# Altium project Wings_SMD_Breakout.PrjPcb
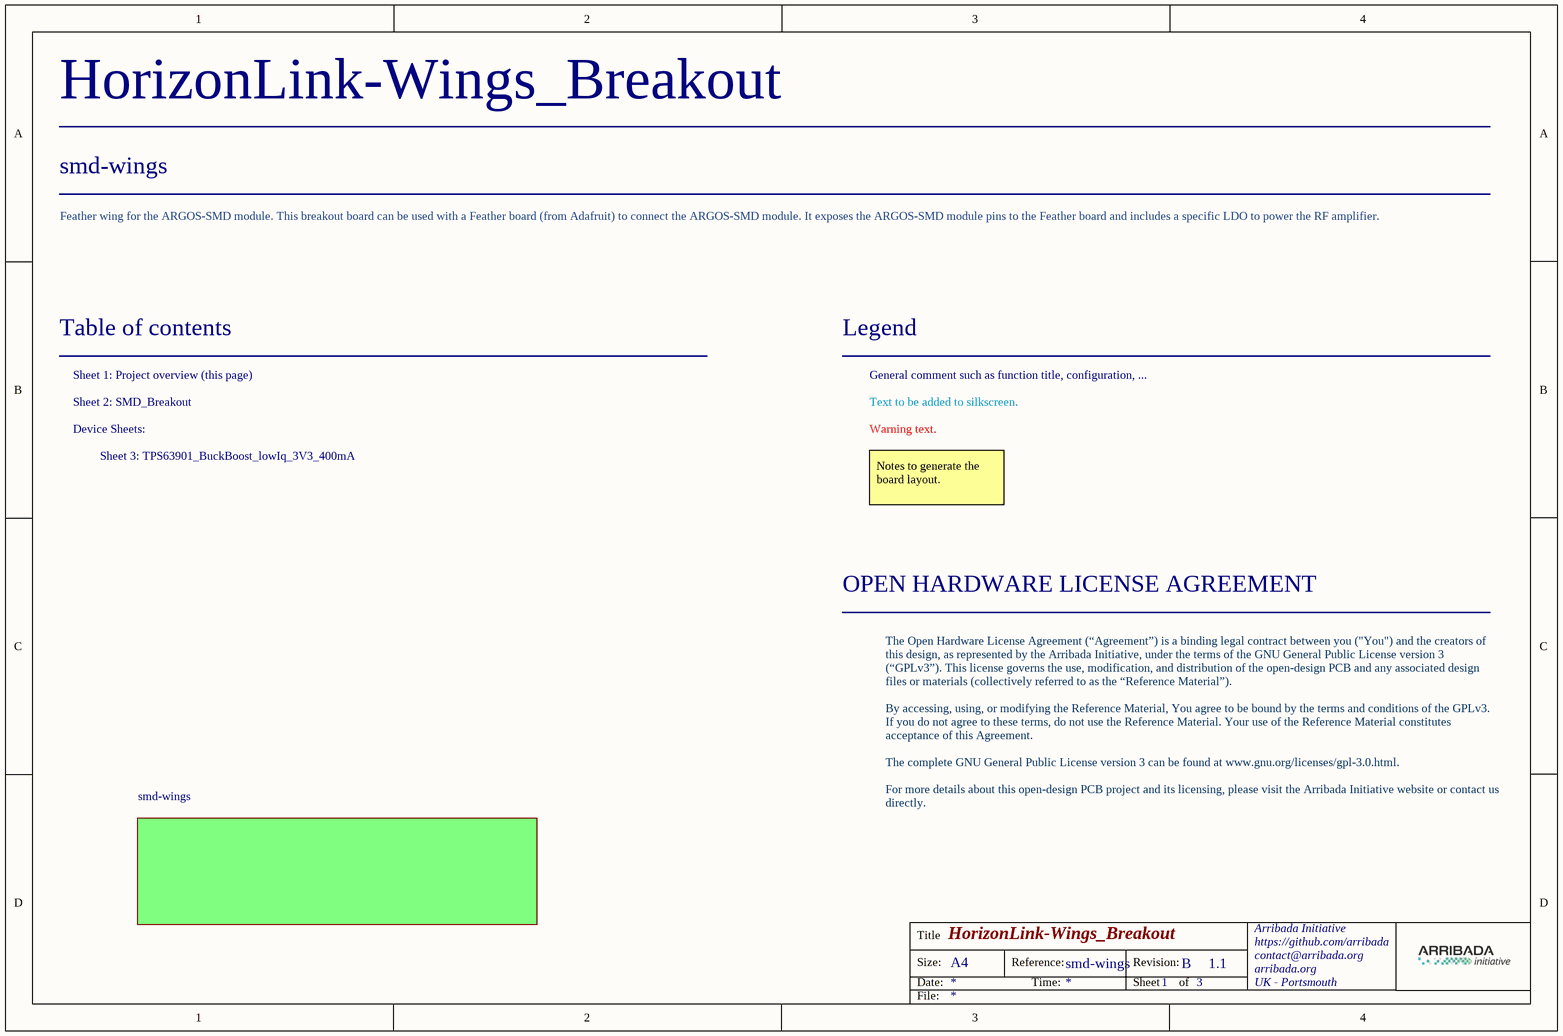
[diagram p0: Project_Overview.SchDoc]
Board_Reference: smd-wings; Board_PCB_Revision: B; Board_Name: HorizonLink-Wings_Breakout; Board_Document_Date: 09/2024; Board_Assembly_Revision: 1.1
2 sheets, 46 parts. Net scope: global (net labels, ports and power ports of the same name join across sheets).
Board file: Wings_SMD_Breakout_v1.1.PcbDoc
Sheets:
  Project_Overview.SchDoc
    smd-wings = SMD_Breakout.SchDoc

## Sheet Project_Overview.SchDoc
size A4; Organization: Arribada Initiative; Address1: https://github.com/arribada; Address2: contact@arribada.org; Address3: arribada.org; Address4: UK - Portsmouth; DocumentNumber: 1; SheetNumber: 1; SheetTotal: 3

### Sub-sheets
smd-wings = SMD_Breakout.SchDoc: no entries

### Notes on the sheet
- Feather wing for the ARGOS-SMD module. This breakout board can be used with a Feather board (from Adafruit) to connect the ARGOS-SMD module. It exposes the ARGOS-SMD module pins to the Feather board and includes a specific LDO to power the RF amplifier.
- Table of contents
- Sheet 1: Project overview (this page)
- Legend
- General comment such as function title, configuration, ...
- Sheet 2: SMD_Breakout
- Device Sheets:
- Text to be added to silkscreen.
- Warning text.
- Sheet 3: TPS63901_BuckBoost_lowIq_3V3_400mA
- Notes to generate the board layout.
- OPEN HARDWARE LICENSE AGREEMENT
- The Open Hardware License Agreement (“Agreement”) is a binding legal contract between you ("You") and the creators of this design, as represented by the Arribada Initiative, under the terms of the GNU General Public License version 3 (“GPLv3”). This license governs the use, modification, and distribution of the open-design PCB and any associated design files or materials (collectively referred to as the “Reference Material”).
  By accessing, using, or modifying the Reference Material, You agree to be bound by the terms and conditions of the GPLv3. If you do not agree to these terms, do not use the Reference Material. Your use of the Reference Material constitutes acceptance of this Agreement.
  The complete GNU General Public License version 3 can be found at www.gnu.org/licenses/gpl-3.0.html.
  For more details about this open-design PCB project and its licensing, please visit the Arribada Initiative website or contact us directly.
- Title
- Size:
- Date:
- A4
- Reference:
- Time:
- Revision:
- Sheet
- of
- File:

## Sheet SMD_Breakout.SchDoc
size A4; Organization: Arribada Initiative; Address1: https://github.com/arribada; Address2: contact@arribada.org; Address3: arribada.org; Address4: UK - Portsmouth; DocumentNumber: 2; SheetNumber: 2; SheetTotal: 3
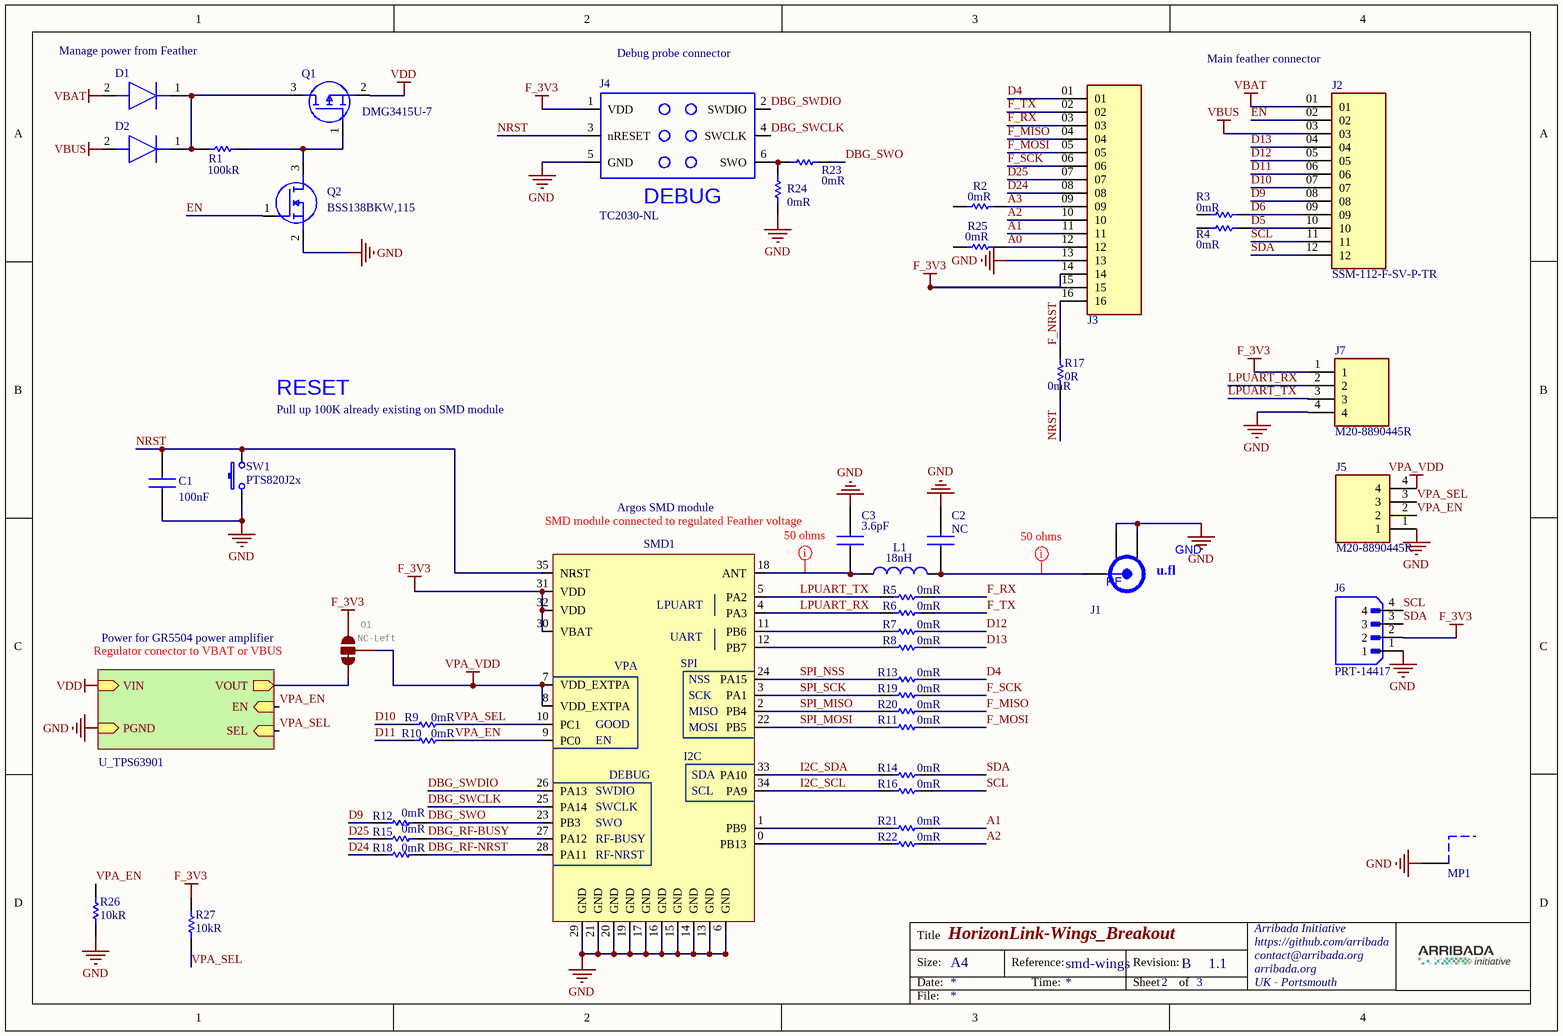
[diagram p1: SMD_Breakout.SchDoc]

### Parts
C1  value 100nF  [0402]  (hidden comment: GRM155R71C104KA88D)
C2  NC  [CAPC1005X55N]
C3  value 3.6pF  [CAPC1005X55N]  (hidden comment: CC0402BRNPO9BN3R6)
D1  MBR120LSFT3G  [SODFL3616X98N]  (value not drawn)
D2  MBR120LSFT3G  [SODFL3616X98N]  (value not drawn)
J1  20279-001E-01  [MHF SMT REC]  (value not drawn)
J2  SSM-112-F-SV-P-TR  [SAMTEC_SSM-112-F-SV-P-TR]
J3  SSM-116-F-SV-P-TR  [SAMTEC_SSM-116-F-SV-P-TR]  (value not drawn)
J4  TC2030-NL  [TC2030NL]
J5  M20-8890445R  [M208890445R]
J6  PRT-14417  [SPARKFUN_PRT-14417]
J7  M20-8890445R  [M208890445R]
L1  value 18nH  [LQW18AN10NG80D]  (hidden comment: LQW18AN18NG8ZD)
MP1  36103255S  [36103255S]  (value not drawn)
O1  NC-Left  [SMT-JUMPER_3_2-NCLEFT_TRACE_SILK]  (net tie, no BOM)
Q1  DMG3415U-7  [SOT96P240X120-3N]
Q2  BSS138BKW,115  [SOT65P210X110-3N]
R1  value 100kR  [RESC2012X60N]  (hidden comment: RC0805JR07100KL)
R2  value 0mR  [RESC1005X40N]  (hidden comment: 0R)
R3  value 0mR  [RESC1005X40N]  (hidden comment: 0R)
R4  value 0mR  [RESC1005X40N]  (hidden comment: 0R)
R5  value 0mR  [RESC1005X40N]  (hidden comment: 0R)
R6  value 0mR  [RESC1005X40N]  (hidden comment: 0R)
R7  value 0mR  [RESC1005X40N]  (hidden comment: 0R)
R8  value 0mR  [RESC1005X40N]  (hidden comment: 0R)
R9  value 0mR  [RESC1005X40N]  (hidden comment: 0R)
R10  value 0mR  [RESC1005X40N]  (hidden comment: 0R)
R11  value 0mR  [RESC1005X40N]  (hidden comment: 0R)
R12  value 0mR  [RESC1005X40N]  (hidden comment: 0R)
R13  value 0mR  [RESC1005X40N]  (hidden comment: 0R)
R14  value 0mR  [RESC1005X40N]  (hidden comment: 0R)
R15  value 0mR  [RESC1005X40N]  (hidden comment: 0R)
R16  value 0mR  [RESC1005X40N]  (hidden comment: 0R)
R17  0R  value 0mR  [RESC1005X40N]
R18  value 0mR  [RESC1005X40N]  (hidden comment: 0R)
R19  value 0mR  [RESC1005X40N]  (hidden comment: 0R)
R20  value 0mR  [RESC1005X40N]  (hidden comment: 0R)
R21  value 0mR  [RESC1005X40N]  (hidden comment: 0R)
R22  value 0mR  [RESC1005X40N]  (hidden comment: 0R)
R23  value 0mR  [RESC1005X40N]  (hidden comment: 0R)
R24  value 0mR  [RESC1005X40N]  (hidden comment: 0R)
R25  value 0mR  [RESC1005X40N]  (hidden comment: 0R)
R26  value 10kR  [RESC1005X40N]  (hidden comment: CRCW040210K0JNEDC)
R27  value 10kR  [RESC1005X40N]  (hidden comment: CRCW040210K0JNEDC)
SMD1  stm32wl-SMD  [stm32wl-SMD_noLegs]  (value not drawn)
SW1  PTS820J2x  [TL1015]

### Sub-sheets
U_TPS63901 = TPS63901_BuckBoost_lowIq_3V3_400mA (file not in this document): VIN (in), VOUT (out), EN (in), SEL (in), PGND (in)

### Nets
F_3V3: J3.14 J3.15 J4.1(VDD) J6.2 J7.1 O1.3 R27.1 SMD1.30(VBAT) SMD1.31(VDD) SMD1.32(VDD)
GND: C1.1 C2.1 C3.2 J1.2(GND) J1.3(GND) J3.13 J4.5(GND) J5.1 J6.1 J7.4 MP1.1 Q2.2(S) R24.1 R26.2 SMD1.6(GND) SMD1.13(GND) SMD1.14(GND) SMD1.15(GND) SMD1.16(GND) SMD1.17(GND) SMD1.19(GND) SMD1.20(GND) SMD1.21(GND) SMD1.29(GND) SW1.1 SW1.G1 SW1.G2 SW1.G3 SW1.G4 ; sheet U_TPS63901/PGND
VBAT: D1.2(A) J2.01
VBUS: D2.2(A) J2.03
VDD: Q1.2(S) ; sheet U_TPS63901/VIN
VPA_VDD: J5.4 O1.2 SMD1.7(VDD_EXTPA) SMD1.8(VDD_EXTPA)
A0: J3.12 R25.2
A1: J3.11 R21.1
A2: J3.10 R22.1
A3: J3.09 R2.2
D4: J3.01 R13.1
D5: J2.10 R4.2
D6: J2.09 R3.2
D9: J2.08 R12.1
D10: J2.07 R9.2
D11: J2.06 R10.2
D12: J2.05 R7.2
D13: J2.04 R8.2
D24: J3.08 R18.1
D25: J3.07 R15.1
DBG_RF-BUSY: R15.2 SMD1.27(PA12)
DBG_RF-NRST: R18.2 SMD1.28(PA11)
DBG_SWCLK: J4.4(SWCLK) SMD1.25(PA14)
DBG_SWDIO: J4.2(SWDIO) SMD1.26(PA13)
DBG_SWO: R12.2 R23.2 SMD1.23(PB3)
EN: J2.02 Q2.1(G)
F_MISO: J3.04 R20.1
F_MOSI: J3.05 R11.1
F_NRST: J3.16 R17.2
F_RX: J3.03 R5.1
F_SCK: J3.06 R19.1
F_TX: J3.02 R6.1
I2C_SCL: R16.2 SMD1.34(PA9)
I2C_SDA: R14.2 SMD1.33(PA10)
LPUART_RX: J7.2 R6.2 SMD1.4(PA3)
LPUART_TX: J7.3 R5.2 SMD1.5(PA2)
NRST: C1.2 J4.3(nRESET) R17.1 SMD1.35(NRST) SW1.2
SCL: J2.11 J6.4 R16.1
SDA: J2.12 J6.3 R14.1
SPI_MISO: R20.2 SMD1.2(PB4)
SPI_MOSI: R11.2 SMD1.22(PB5)
SPI_NSS: R13.2 SMD1.24(PA15)
SPI_SCK: R19.2 SMD1.3(PA1)
VPA_EN: J5.2 R10.1 R26.1 SMD1.9(PC0) ; sheet U_TPS63901/EN
VPA_SEL: J5.3 R9.1 R27.2 SMD1.10(PC1) ; sheet U_TPS63901/SEL
NetC2_2: C2.2 J1.1(RF) L1.2
NetC3_1: C3.1 L1.1 SMD1.18(ANT)
NetD1_1: D1.1(K) D2.1(K) Q1.3(D) R1.1
NetJ4_6: J4.6(SWO) R23.1 R24.2
NetO1_1: O1.1 ; sheet U_TPS63901/VOUT
NetQ1_1: Q1.1(G) Q2.3(D) R1.2
NetR7_1: R7.1 SMD1.11(PB6)
NetR8_1: R8.1 SMD1.12(PB7)
NetR21_2: R21.2 SMD1.1(PB9)
NetR22_2: R22.2 SMD1.0(PB13)

Not connected (* = marked no-connect by the designer): R2 1; R3 1; R4 1; R25 1

### Layout directives
net class 50Ohms: NetC2_2, NetC3_1

### Notes on the sheet
- (near D1) Manage power from Feather
- (near J4) Debug probe connector
- (near J2) Main feather connector
- RESET
- Pull up 100K already existing on SMD module
- Argos SMD module
- (near C3) SMD module connected to regulated Feather voltage
- (near J1) u.fl
- (near O1) Regulator conector to VBAT or VBUS
- (near O1) Power for GR5504 power amplifier
- Title
- Size:
- Date:
- A4
- Reference:
- Time:
- Revision:
- Sheet
- of
- File:
- (in symbol stm32wl-SMD) LPUART; UART; VPA; SPI; NSS; SCK; MISO; GOOD; MOSI; EN; I2C; DEBUG; SDA; SWDIO; SCL; SWCLK; SWO; RF-BUSY; RF-NRST
- (in symbol TC2030-NL) DEBUG

### Library data of the parts
C1 = GRM155R71C104KA88D: Multilayer Ceramic Capacitors MLCC - SMD/SMT 0.1 uF 16 VDC 10% 0402 X7R; Manufacturer_Part_Number: CC0402KRX7R7BB104; Manufacturer: YAGEO; Manufacturer 1: Murata; Description 1: 0402 0.1 uF 16V ±10 % Tolerance X7R SMT Multilayer Ceramic Capacitor; Voltage Rating: 16V; Package: C0402; Supplier 1: Mouser; Supplier Part Number 1: 81-GRM155R71C104KA88; Manufacturer Part Number 1: GRM155R71C104KA88D; RoHS 1: Yes; Category 1: Ceramic Capacitors; Stock 1: 7816691; Pricing 1: 1=0,1, 10=0,017, 50=0,017, 100=0,01, 1000=0,008, 10000=0,005 (USD); Mount: Surface Mount; Case/Package: 0402; Number of Pins: 2; Case Code (Metric): 1005; Case Code (Imperial): 0402; Material: Ceramic; Dielectric Material: Ceramic; Min Operating Temperature: -55°C; Max Operating Temperature: 125°C; Capacitance: 100nF; Tolerance: 10%; Packaging: Tape and Reel; Voltage Rating (DC): 16V; Package Quantity: 1; Dielectric: X7R; Termination: SMD/SMT; Voltage: 16V; Series: GRM; Length: 1mm; Width: 0.02inch; Height: 0.5mm; Thickness: 0.022inch; Depth: 0.5mm; Radiation Hardening: No; Lead Free: Lead Free; RoHS Compliant: Yes; Reach SVHC Compliant: Unknown; ComponentLink1URL: https://datasheet.ciiva.com/129/grm155r71c104ka88-01-129739.pdf?src-supplier=Digi-Key; ComponentLink1Description: https://datasheet.ciiva.com/129/grm155r71c104ka88-01-129739.pdf?src-supplier=Digi-Key; ComponentLink2URL: https://datasheet.ciiva.com/129/grm155r71c104ka88-01-129740.pdf?src-supplier=Digi-Key; ComponentLink2Description: https://datasheet.ciiva.com/129/grm155r71c104ka88-01-129740.pdf?src-supplier=Digi-Key; ComponentLink3URL: https://datasheet.ciiva.com/29199/454098-da-01-en-vs-kondensator-0402-29199799.pdf?src-supplier=Conrad; ComponentLink3Description: https://datasheet.ciiva.com/29199/454098-da-01-en-vs-kondensator-0402-29199799.pdf?src-supplier=Conrad; ComponentLink4URL: https://datasheet.ciiva.com/7937/4360-7937615.pdf?src-supplier=Element14; ComponentLink4Description: https://datasheet.ciiva.com/7937/4360-7937615.pdf?src-supplier=Element14; ComponentLink5URL: https://datasheet.ciiva.com/14116/grmseries-highdielectrictype-eng-14116878.pdf?src-supplier=Distrelec; ComponentLink5Description: https://datasheet.ciiva.com/14116/grmseries-highdielectrictype-eng-14116878.pdf?src-supplier=Distrelec; ComponentLink6URL: https://datasheet.ciiva.com/14103/grmseries-highdielectrictype-eng-14103750.pdf?src-supplier=Distrelec; ComponentLink6Description: https://datasheet.ciiva.com/14103/grmseries-highdielectrictype-eng-14103750.pdf?src-supplier=Distrelec; ComponentLink7URL: https://datasheet.ciiva.com/28534/4360-28534127.pdf?src-supplier=Element14; ComponentLink7Description: https://datasheet.ciiva.com/28534/4360-28534127.pdf?src-supplier=Element14; ComponentLink8URL: https://datasheet.ciiva.com/28534/4360-28534133.pdf?src-supplier=Element14; ComponentLink8Description: https://datasheet.ciiva.com/28534/4360-28534133.pdf?src-supplier=Element14
C2 = GEN_CAP_0402: Generic capacitor; ComponentLink1Description: Mouser; ComponentLink1URL: https://www.mouser.fr/ProductDetail/Murata-Electronics/GCM1555C1H4R7CA16D?qs=jDWTHf1mkXZYnVNtgyfFgw%3D%3D
C3 = CC0402BRNPO9BN3R6: Multilayer Ceramic Capacitors MLCC - SMD/SMT 50 V 3.6pF C0G 0402 Tol 0.1pF; Manufacturer_Name: KEMET; Datasheet Link: https://www.yageo.com/upload/media/product/productsearch/datasheet/mlcc/UPY-GP_NP0_16V-to-50V_18.pdf; Height: 0.55mm; Manufacturer_Part_Number: CC0402BRNPO9BN3R6; Mouser Part Number: 603-CC402BRNPO9BN3R6; Mouser Price/Stock: https://www.mouser.co.uk/ProductDetail/Yageo/CC0402BRNPO9BN3R6?qs=57cj7OiSijl%2FHGuB4N4%2Few%3D%3D; Arrow Part Number: CC0402BRNPO9BN3R6; Arrow Price/Stock: https://www.arrow.com/en/products/cc0402brnpo9bn3r6/yageo
D1 D2 = MBR120LSFT3G: Schottky Diodes & Rectifiers 1A 20V; Manufacturer_Name: onsemi; Datasheet Link: http://www.onsemi.com/pub/Collateral/MBR120LSFT1-D.PDF; Height: 0.98mm; Manufacturer_Part_Number: MBR120LSFT3G; Mouser Part Number: 863-MBR120LSFT3G; Mouser Price/Stock: https://www.mouser.co.uk/ProductDetail/onsemi/MBR120LSFT3G?qs=3JMERSakebrl0QzFyBgvHg%3D%3D; Arrow Part Number: MBR120LSFT3G; Arrow Price/Stock: https://www.arrow.com/en/products/mbr120lsft3g/on-semiconductor?region=nac
J1 = 20279-001E-01: CON IPEX MHF SMT RECEPTACLE RF DC - 6GHZ VSWR: 1.3 max. at 0.1-3GHz; VSWR: 1.5 max. at 3-6GHz; Manufacturer: Taoglas; Manufacturers Part Number: RECE-20279-001E-01; Size: MHF; Frequency Range: DC - 6GHz; Supplier 1: Digi-Key; Supplier 2: Mouser; Supplier Part Number 1: 931-1107-1-ND; Supplier Part Number 2: 960-RECE20279001E01; Distributor 1: EBV; Distributor 2: Future Electronics
J2 = SSM-112-F-SV-P-TR: Headers & Wire Housings Surface Mount, 12pos, PCB Socket Strips, .100" pitch
J3 = SSM-116-F-SV-P-TR: Headers & Wire Housings Surface Mount, 16pos,  PCB Socket Strips, .100" pitch; Supplier 1: Digi-Key; Supplier Part Number 1: SSM-116-F-SV-P-ND; Supplier 2: Digi-Key; Supplier Part Number 2: SSM-116-F-SV-ND
J4 = TC2030-NL: CON PLUG OF NAILS 6 PIN FOOTPRINT NO LEGS; Manufacturer: Tag-Connect; Manufacturers Part Number: NOT FITTED PART; Supplier Part Number 1: NOT FITTED PART; Supplier Part Number 2: NOT FITTED PART; Distributor 1: EBV; Distributor 2: Future Electronics
J5 J7 = M20-8890445R: Connector; Manufacturer_Name: Harwin; Datasheet Link: https://cdn.harwin.com/pdfs/M20-889.pdf; Height: 2.65mm; Manufacturer_Part_Number: M20-8890445R; Mouser Part Number: 855-M20-8890445R; Mouser Price/Stock: https://www.mouser.co.uk/ProductDetail/Harwin/M20-8890445R?qs=k41KVqW3ymoiw3ZBsQPrmw%3D%3D
J6 = PRT-14417: QWIIC JST CONNECTOR - SMD 4-PIN; MF: SparkFun Electronics; SnapEDA_Link: https://www.snapeda.com/parts/PRT-14417/SparkFun+Electronics/view-part/?ref=snap; Package: None; Value: *; MP: PRT-14417; Check_prices: https://www.snapeda.com/parts/PRT-14417/SparkFun+Electronics/view-part/?ref=eda
L1 = LQW18AN18NG8ZD: Inductor Wirewound , 18 nH, 75 Milliohm, ± 2%, 1.4 A, 0603 [1608 Metric]; Supplier 1: Mouser; Supplier Part Number 1: 81-LQW18AN18NG8ZD
MP1 = 36103255S: WE-SHC Shielding Cabinet, SMT Frame, Tin Plated, Tray, 25x25x3mm; Manufacturer: Wurth Elektronik; Base Material: Steel; ComponentLink1Description: Website Link; ComponentLink1URL: https://www.we-online.com/redexpert/article/36103255S?ad; ComponentLink2Description: Datasheet Link; ComponentLink2URL: https://www.we-online.com/redexpert/spec/36103255S?ad; Manufacturer Part Number: 36103255S; Category: EMC Shielding; Match Code: WE-SHC; Mount: Surface Mount; Operating Temperature Max: 125°C; Operating Temperature Min: -40°C; Packaging: Tray; Length: 25mm; Width: 25mm; Height: 3mm; Plating: Tin Plated; Type: SMT Frame
O1 = JUMPER-SMT_3_2-NCLEFT_TRACE_SILK: Normally opened lefttrace jumper (1 of 2 connections)    This jumper has a trace between left pad pads so they are normally closed (NC). Use a razor knife to open the connection(s). For best results follow the IPC guidelines for cutting traces: Cutout at least 0.063 mm (0.005 in).  Remove all loose material to clean up the cut area.  Seal the cut with an approved epoxy.       Reapply solder to reclose the connection(s).; GateName_1: G$1; SymbolName_1: SMT-JUMPER_3_2-NC_TRACE; DeviceName: _SILK; DeviceSetName: JUMPER-SMT_3_2-NC_TRACE; LibraryName: SparkFun-Jumpers
Q1 = DMG3415U-7: MOSFET (P-Channel) 16V Enh FET 8Vgss -12A 0.65W; Manufacturer_Name: Diodes Inc.; Datasheet Link: https://datasheet.datasheetarchive.com/originals/distributors/Datasheets-DGA23/1579852.pdf; Height: 1.2mm; Manufacturer_Part_Number: DMG3415U-7; Mouser Part Number: 621-DMG3415U-7; Mouser Price/Stock: https://www.mouser.co.uk/ProductDetail/Diodes-Incorporated/DMG3415U-7?qs=oUsD4qhOtFwqFLkI6WCRAA%3D%3D; Arrow Part Number: DMG3415U-7; Arrow Price/Stock: https://www.arrow.com/en/products/dmg3415u-7/diodes-incorporated?region=nac
Q2 = BSS138BKW,115: MOSFET (N-Channel); Manufacturer_Name: Nexperia; Datasheet Link: https://assets.nexperia.com/documents/data-sheet/BSS138BKW.pdf; Height: 1.1mm; Manufacturer_Part_Number: BSS138BKW,115; Mouser Part Number: 771-BSS138BKW115; Mouser Price/Stock: https://www.mouser.co.uk/ProductDetail/Nexperia/BSS138BKW115?qs=A1cBxND5mHJ1Grk7RQmcgg%3D%3D; Arrow Part Number: BSS138BKW,115; Arrow Price/Stock: https://www.arrow.com/en/products/bss138bkw115/nexperia?region=nac
R1 = RC0805JR07100KL: Thick Film Resistors - SMD 100 kOhms 125 mW 0805 5%; Manufacturer_Name: KEMET; Datasheet Link: https://www.yageo.com/upload/media/product/productsearch/datasheet/rchip/PYu-RC_Group_51_RoHS_L_11.pdf; Height: 0.6mm; Manufacturer_Part_Number: RC0805JR07100KL; Arrow Part Number: RC0805JR07100KL; Arrow Price/Stock: https://www.arrow.com/en/products/rc0805jr-07100kl/yageo?region=nac
R2-R25 = CRCW04020000Z0ED: Thick Film Resistors  - SMD 0402 0.063 W 0 Ohm Jumper; Manufacturer 1: Vishay; Description 1: CRCW Series 0402 0.063 W 0 Ohm Jumper Surface Mount Thick Film Chip Resistor; Category 1: Chip SMD Resistors; Power Rating: 63mW; Voltage Rating: 50V; Temperature Coefficient: 100ppm/°C; Tolerance: 5%; Supplier 1: Digi-Key; Supplier Part Number 1: 541-0.0JCT-ND; Manufacturer Part Number 1: CRCW04020000Z0ED; RoHS 1: Yes; Stock 1: 170588; Pricing 1: 1=0,1, 10=0,029, 25=0,0208, 50=0,016, 100=0,0118, 250=0,009, 500=0,0072, 1000=0,0053, 5000=0,0038 (USD); Case/Package: 0402; Case Code (Imperial): 0402; Case Code (Metric): 1005; Contact Plating: Tin; Size Code: 0402; Weight: 2.3E-05oz; Min Operating Temperature: -55°C; Max Operating Temperature: 155°C; Packaging: Tape and Reel; Resistance: 0mR; Series: CRCW; Number of Terminations: 2; Max Power Dissipation: 63mW; Termination: SMD/SMT; Package Quantity: 10000; Resistor Type: Thick Film; Voltage Rating (DC): 50V; Features: Automotive AEC-Q200; Construction: Rectangular; Length: 1mm; Width: 0.5mm; Height: 0.35mm; Depth: 0.5mm; Ratings: AEC-Q200; Radiation Hardening: No; RoHS Compliant: Yes; Lead Free: Lead Free; Reach SVHC Compliant: Unknown; Military Standard: Not; ComponentLink1URL: https://datasheet.ciiva.com/3255/dcrcwe3-3255944.pdf?src-supplier=Avnet; ComponentLink1Description: https://datasheet.ciiva.com/3255/dcrcwe3-3255944.pdf?src-supplier=Avnet; ComponentLink2URL: https://datasheet.ciiva.com/3255/dcrcwe3-3255945.pdf?src-supplier=Avnet; ComponentLink2Description: https://datasheet.ciiva.com/3255/dcrcwe3-3255945.pdf?src-supplier=Avnet; ComponentLink3URL: https://datasheet.ciiva.com/2461/dcrcwe3-2461962.pdf?src-supplier=Digi-Key; ComponentLink3Description: https://datasheet.ciiva.com/2461/dcrcwe3-2461962.pdf?src-supplier=Digi-Key; ComponentLink4URL: https://datasheet.ciiva.com/7841/1720486-7841802.pdf?src-supplier=Element14; ComponentLink4Description: https://datasheet.ciiva.com/7841/1720486-7841802.pdf?src-supplier=Element14; ComponentLink5URL: https://datasheet.ciiva.com/2461/dcrcwe3-2461964.pdf?src-supplier=Digi-Key; ComponentLink5Description: https://datasheet.ciiva.com/2461/dcrcwe3-2461964.pdf?src-supplier=Digi-Key; ComponentLink6URL: https://datasheet.ciiva.com/7841/1697337-7841468.pdf?src-supplier=Element14; ComponentLink6Description: https://datasheet.ciiva.com/7841/1697337-7841468.pdf?src-supplier=Element14; ComponentLink7URL: https://datasheet.ciiva.com/16761/70200976-16761309.pdf?src-supplier=Allied+Electronics; ComponentLink7Description: https://datasheet.ciiva.com/16761/70200976-16761309.pdf?src-supplier=Allied+Electronics; ComponentLink8URL: https://datasheet.ciiva.com/26311/fld-crcw-e3-data-en-26311550.pdf?src-supplier=Distrelec; ComponentLink8Description: https://datasheet.ciiva.com/26311/fld-crcw-e3-data-en-26311550.pdf?src-supplier=Distrelec
R26 R27 = CRCW040210K0JNEDC: Thick Film Resistors - SMD 1/16watt 10Kohms 5% Commercial Use; Manufacturer: Vishay Semiconductors; Power Rating: 63mW; Voltage Rating: 50V; Supplier 1: Mouser; Manufacturer Part Number: CRCW040210K0JNEDC; RoHS: Yes; Category: Chip SMD Resistors; Stock 1: 229087; Pricing 1: 1=0,1, 10=0,013, 50=0,013, 100=0,007, 1000=0,005, 10000=0,004 (USD); Case/Package: 343Case; Resistance: 10kR; Tolerance: 5%; Height: 350um; Lead Free: 5697LeadFree; ComponentLink1URL: http://www.vishay.com/docs/28773/crcwce3.pdf?src-supplier=Digikey; ComponentLink1Description: http://www.vishay.com/docs/28773/crcwce3.pdf?src-supplier=Digikey; ComponentLink2URL: https://datasheet.octopart.com/CRCW040210K0JNEDC-Vishay-datasheet-100063072.pdf?src-supplier=Future+Electronics; ComponentLink2Description: https://datasheet.octopart.com/CRCW040210K0JNEDC-Vishay-datasheet-100063072.pdf?src-supplier=Future+Electronics; Supplier Part Number 1: 71-CRCW040210K0JNEDC
SMD1 = stm32wl-SMD: Arribada SMD module Argos comunication with PA GR5504
SW1 = PTS820J2x: SW SPST PB 50MA 12V SMT CK variant; Manufacturer: C&K; Manufacturers Part Number: PTS820J2xM SMTR LFS; Supplier 1: Mouser; Supplier 2: Digi-Key; Supplier Part Number 1: 611-PTS820J25MSMTR; Supplier Part Number 2: CKN10505CT-ND; Distributor 1: EBV; Distributor 2: Future Electronics; Value: PTS820J2x

## Assembly variants
only_uart: not fitted C2 MP1 R2 R3 R4 R7 R8 R9 R10 R11 R12 R13 R14 R15 R16 R19 R20 R21 R22 R23 R29